# EAGLE design VGA-OSCI_SMD (EAGLE 6.6.0)
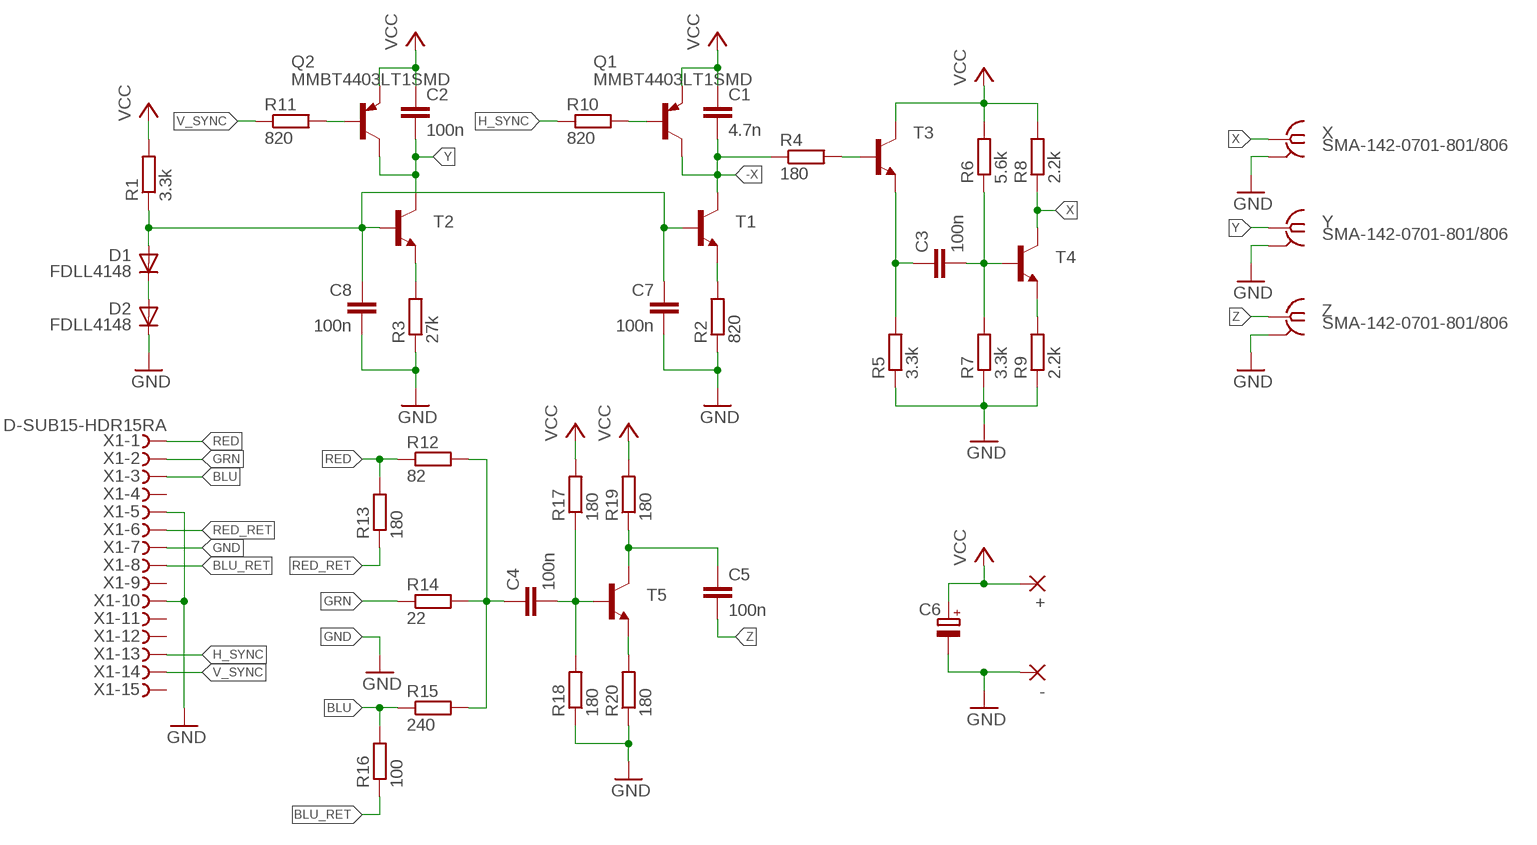
[diagram p0: schematic, sheet 1]

## Parts
+  WIREPADSMD1,27-254  [SMD1,27-2,54]
-  WIREPADSMD1,27-254  [SMD1,27-2,54]
C1  4.7n  C-EUC0603  [C0603]
C2  100n  C-EUC0603  [C0603]
C3  100n  C-EUC0603  [C0603]
C4  100n  C-EUC0603  [C0603]
C5  100n  C-EUC0603  [C0603]
C6  CPOL-EU153CLV-0810  [153CLV-0810]
C7  100n  C-EUC0603  [C0603]
C8  100n  C-EUC0603  [C0603]
D1  FDLL4148  DIODE-SOD80C  [SOD80C]
D2  FDLL4148  DIODE-SOD80C  [SOD80C]
Q1  MMBT4403LT1SMD  MMBT4403LT1-PNP-SOT23-BEC  [SOT23-BEC]
Q2  MMBT4403LT1SMD  MMBT4403LT1-PNP-SOT23-BEC  [SOT23-BEC]
R1  3.3k  R-EU_R0603  [R0603]
R2  820  R-EU_R0603  [R0603]
R3  27k  R-EU_R0603  [R0603]
R4  180  R-EU_R0603  [R0603]
R5  3.3k  R-EU_R0603  [R0603]
R6  5.6k  R-EU_R0603  [R0603]
R7  3.3k  R-EU_R0603  [R0603]
R8  2.2k  R-EU_R0603  [R0603]
R9  2.2k  R-EU_R0603  [R0603]
R10  820  R-EU_R0603  [R0603]
R11  820  R-EU_R0603  [R0603]
R12  82  R-EU_R0603  [R0603]
R13  180  R-EU_R0603  [R0603]
R14  22  R-EU_R0603  [R0603]
R15  240  R-EU_R0603  [R0603]
R16  100  R-EU_R0603  [R0603]
R17  180  R-EU_R0603  [R0603]
R18  180  R-EU_R0603  [R0603]
R19  180  R-EU_R0603  [R0603]
R20  180  R-EU_R0603  [R0603]
T1  MMBT2222ALT1-NPN-SOT23-BEC  [SOT23-BEC]
T2  MMBT2222ALT1-NPN-SOT23-BEC  [SOT23-BEC]
T3  MMBT2222ALT1-NPN-SOT23-BEC  [SOT23-BEC]
T4  MMBT2222ALT1-NPN-SOT23-BEC  [SOT23-BEC]
T5  MMBT2222ALT1-NPN-SOT23-BEC  [SOT23-BEC]
X  SMA-142-0701-801/806  [J502-ND-142-0701-801/806]
X1  D-SUB15-HDR15RA  [HDR15RA]
Y  SMA-142-0701-801/806  [J502-ND-142-0701-801/806]
Z  SMA-142-0701-801/806  [J502-ND-142-0701-801/806]

## Nets
-X: C1.2 Q1.C R4.1 T1.C
BLU: R15.1 R16.2 X1.3
BLU_RET: R16.1 X1.8
GND: -.1(P) C6.- C7.2 C8.2 D2.C R2.1 R3.1 R5.1 R7.1 R9.1 R18.1 R20.1 X1.5 X1.7 X1.10 X.G@1 X.G@2 X.G@3 X.G@4 Y.G@1 Y.G@2 Y.G@3 Y.G@4 Z.G@1 Z.G@2 Z.G@3 Z.G@4
GRN: R14.1 X1.2
GRY_SCL: C4.1 R12.2 R14.2 R15.2
H_SYNC: R10.1 X1.13
N$1: D1.C D2.A
N$2: C7.1 C8.1 D1.A R1.1 T1.B T2.B
N$3: R2.2 T1.E
N$4: R3.2 T2.E
N$5: Q2.B R11.2
N$6: R9.2 T4.E
N$7: C3.2 R6.1 R7.2 T4.B
N$8: C3.1 R5.2 T3.E
N$9: R4.2 T3.B
N$10: Q1.B R10.2
N$11: C4.2 R17.1 R18.2 T5.B
N$13: C5.1 R19.1 T5.C
N$14: R20.2 T5.E
RED: R12.1 R13.2 X1.1
RED_RET: R13.1 X1.6
V_SYNC: R11.1 X1.14
VCC: +.1(P) C1.1 C2.1 C6.+ Q1.E Q2.E R1.2 R6.2 R8.2 R17.2 R19.2 T3.C
X: R8.1 T4.C X.1
Y: C2.2 Q2.C T2.C Y.1
Z: C5.2 Z.1
Unconnected: X1.4 X1.9 X1.11 X1.12 X1.15

## Library data of the parts
+ - = wirepad:WIREPAD: Wire PAD connect wire on PCB
C1-C5 C7 C8 = rcl:C-EU: CAPACITOR, European symbol
C6 = rcl:CPOL-EU: POLARIZED CAPACITOR, European symbol
D1 D2 = diode:DIODE-: DIODE
Q1 Q2 = transistor:*-PNP-: PNP Transistror
R1-R20 = rcl:R-EU_: RESISTOR, European symbol
T1-T5 = transistor:*-NPN-: NPN Transistror BF959 corrected 2008.03.06
X Y Z = con-coax:SMA-: SMA 50 Ohm End Launch Jack Receptacle - Round Contact Johnson Components Source: www.johnsoncomponents.com .. J502-ND.pdf; MF: JOHNSON COMPONENTS; MPN: 142-0701-801; OC_FARNELL: 1608592; OC_NEWARK: 90F2624
X1 = con-thomas-betts:D-SUB15-: D-Subminiatur Connector Source: Electronioc Interconnects European Edition 1998; OC_FARNELL: unknown; OC_NEWARK: unknown

## Board
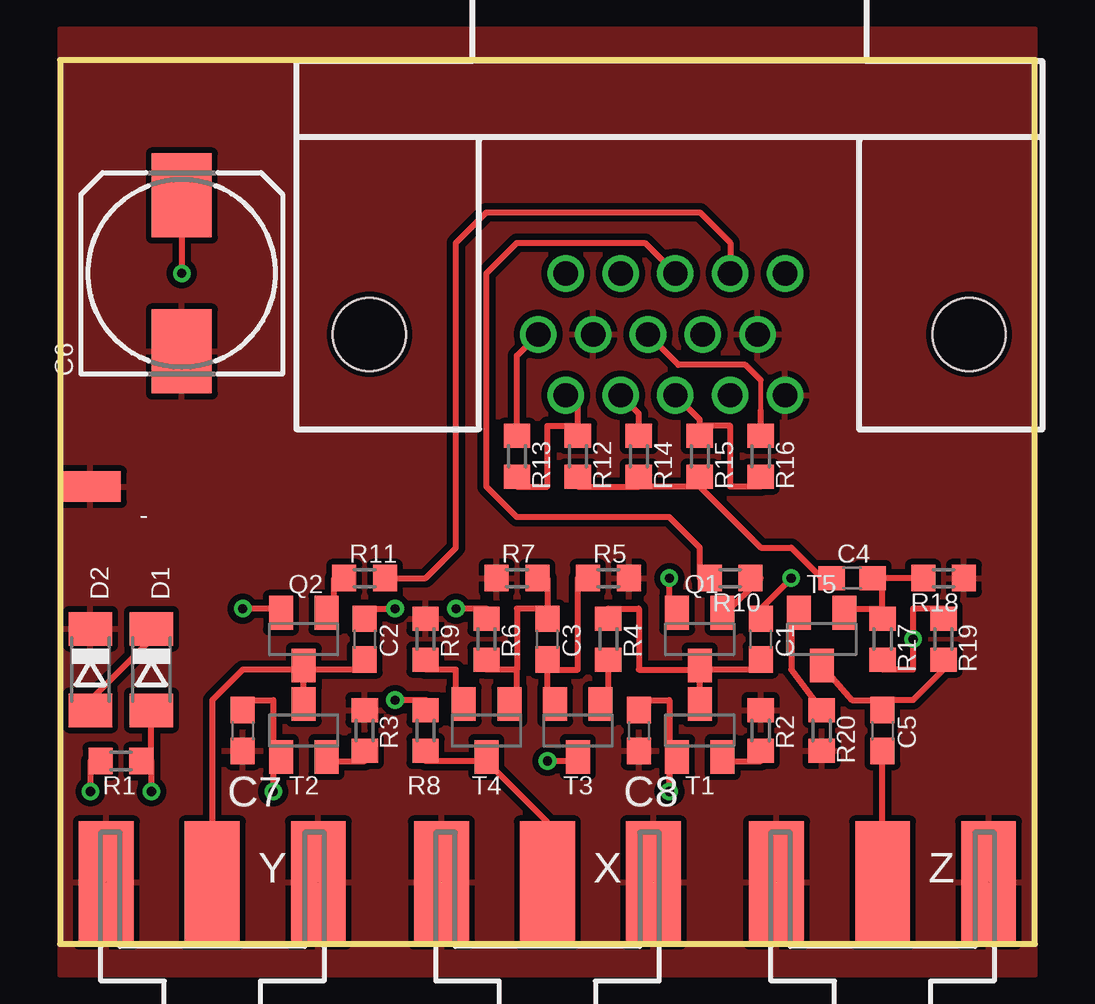
[diagram p1: board, top side]
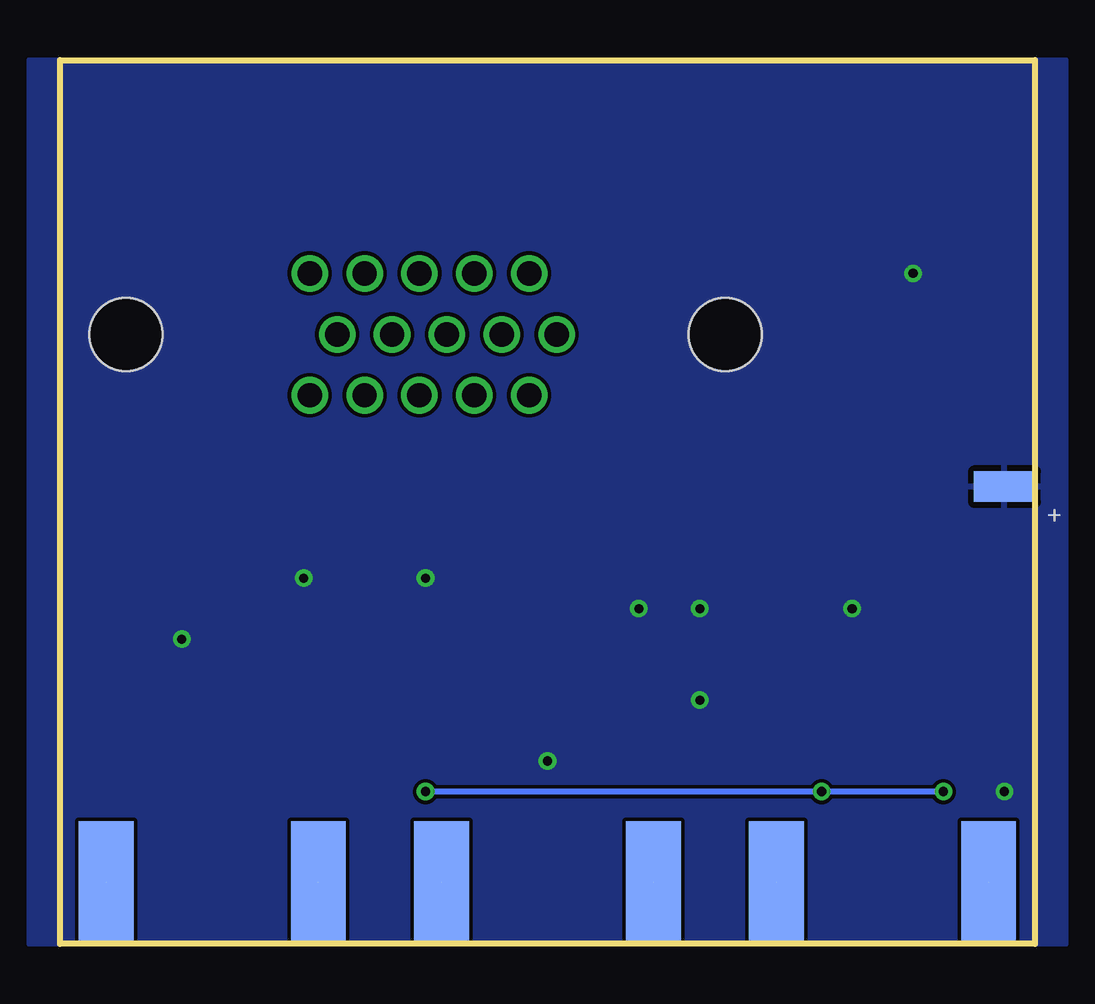
[diagram p2: board, bottom side, seen from below]

Size 40.64 x 36.83 mm. Coordinates in mm from the lower left corner, seen from the top.
Outline: 0,0 40.64,0 40.64,36.83 0,36.83 0,0
Copper layers (1*16): Top 0.035mm / dielectric 1.5mm / Bottom 0.035mm
Design rules "oshpark": minimum track width 6mil, minimum drill 13mil, track to track 6mil, track to pad 6mil, pad to pad 6mil, via to via 6mil, smd to smd 6mil, copper to edge 0mil, drill to drill 8mil, minimum pad ring 10mil, minimum via ring 7mil, stop-mask expansion 4mil, vias tented up to drill 100mil, thermal gap 10mil

### Footprints (pad centres in the part's own frame; a part is rotated, then mirrored left to right if it is on the bottom)
SMD1,27-2,54 = smd 1.27 x 2.54: 1 0,0
C0603 = smd 1.1 x 1: 1 -0.85,0; 2 0.85,0
153CLV-0810 = smd 3.5 x 2.5: + 3.25,0; - -3.25,0
SOD80C = smd 1.4 x 1.8: A 1.7,0; C -1.7,0
SOT23-BEC = smd 1 x 1.4: B -0.95,-1.1; C 0,1.1; E 0.95,-1.1
R0603 = smd 1 x 1.1: 1 -0.85,0; 2 0.85,0
J502-ND-142-0701-801/806 = smd 5.08 x 2.286: 1 2.565,0; G@1 2.565,4.42; G@2 2.565,-4.42 | smd 5.08 x 2.286 bottom: G@3 2.565,4.42; G@4 2.565,-4.42
HDR15RA = drill 1.016: 1 4.318,2.54; 2 2.032,2.54; 3 -0.254,2.54; 4 -2.54,2.54; 5 -4.826,2.54; 6 5.461,0; 7 3.175,0; 8 0.889,0; 9 -1.397,0; 10 -3.683,0; 11 4.318,-2.54; 12 2.032,-2.54; 13 -0.254,-2.54; 14 -2.54,-2.54; 15 -4.826,-2.54 | hole 3.048: -12.497,0; 12.497,0

### Placement (x,y rotation side)
+  1.27,19.05 90 bottom
-  1.27,19.05 90 top
C1  29.21,12.7 270 top
C2  12.7,12.7 270 top
C3  20.32,12.7 90 top
C4  33.02,15.24 0 top
C5  34.29,8.89 270 top
C6  5.08,27.94 90 top
C7  7.62,8.89 270 top
C8  24.13,8.89 270 top
D1  3.81,11.43 270 top
D2  1.27,11.43 270 top
Q1  26.67,12.7 180 top
Q2  10.16,12.7 180 top
R1  2.54,7.62 180 top
R2  29.21,8.89 270 top
R3  12.7,8.89 270 top
R4  22.86,12.7 270 top
R5  22.86,15.24 180 top
R6  17.78,12.7 90 top
R7  19.05,15.24 0 top
R8  15.24,8.89 90 top
R9  15.24,12.7 270 top
R10  27.94,15.24 0 top
R11  12.7,15.24 180 top
R12  21.59,20.32 270 top
R13  19.05,20.32 270 top
R14  24.13,20.32 270 top
R15  26.67,20.32 270 top
R16  29.21,20.32 270 top
R17  34.29,12.7 270 top
R18  36.83,15.24 180 top
R19  36.83,12.7 90 top
R20  31.75,8.89 90 top
T1  26.67,8.89 0 top
T2  10.16,8.89 0 top
T3  21.59,8.89 180 top
T4  17.78,8.89 180 top
T5  31.75,12.7 180 top
X  20.32,0 90 top
X1  25.4,25.4 180 top
Y  6.35,0 90 top
Z  34.29,0 90 top

### Tracks (layer width: path | path; a pad name or v marks a point on that pad's centre or on a via)
-X
  Top 0.254: T1.C 26.67,11.43 | Q1.C 26.67,11.43 | 26.67,11.43 29.21,11.43 C1.2 | R4.1 22.86,13.97 24.13,13.97 24.13,11.43 26.67,11.43
BLU
  Top 0.254: 26.67,21.59 26.67,21.84 X1.3 | R16.2 29.21,19.05 27.94,19.05 27.94,21.59 26.67,21.59 | 26.67,21.59 R15.1
BLU_RET
  Top 0.203: 29.21,22.22 29.21,23.5
  Top 0.254: R16.1 29.21,22.22 | 29.21,23.5 28.57,24.13 25.78,24.13 X1.8
GND  (6 unrouted)
  pour Top (isolate 0.254): 0,-1.27 40.64,-1.27 40.64,38.1 0,38.1
GRN
  Top 0.254: R14.1 24.13,22.1 X1.2
GRY_SCL
  Top 0.254: R12.2 21.59,19.05 24.13,19.05 | R15.2 26.67,19.05 | 26.67,19.05 24.13,19.05 | 24.13,19.05 R14.2 | 26.67,19.05 29.21,16.51 30.48,16.51 31.75,15.24 C4.1
H_SYNC
  Top 0.254: R10.1 26.67,15.24 26.67,16.51 25.4,17.78 19.05,17.78 17.78,19.05 17.78,27.94 19.05,29.21 24.38,29.21 X1.13
N$1
  Top 0.254: D2.A 1.27,10.16 3.81,12.7 D1.C
N$2  (via drill 0.38)
  Top 0.254: R1.1 3.81,7.62 | 3.81,7.62 D1.A | 3.81,7.62 v3.81,6.35 | 8.89,7.62 9.04,7.62 T2.B 9.06,7.79 8.89,7.62 | 8.89,7.62 v8.89,6.35 | T1.B 25.55,7.62 25.4,7.62 v25.4,6.35 25.4,10.16 24.13,10.16 C8.1 | C7.1 7.62,10.16 8.89,10.16 8.89,7.62
  Bottom 0.254: v3.81,6.35 v8.89,6.35 v25.4,6.35
N$3
  Top 0.254: T1.E 27.77,7.79 27.94,7.62 29.21,7.62 R2.2
N$4
  Top 0.254: T2.E 11.26,7.79 11.43,7.62 12.7,7.62 R3.2
N$5
  Top 0.254: Q2.B 11.26,13.8 11.43,13.97 11.43,15.24 R11.2
N$6
  Top 0.254: T4.E 16.68,9.99 16.51,10.16 16.51,11.43 15.24,11.43 R9.2
N$7
  Top 0.254: C3.2 20.32,13.97 | 19.05,11.43 19.05,13.97 20.32,13.97 | R7.2 20.32,15.24 20.32,13.97 | 19.05,11.43 19.05,10.16 18.88,9.99 T4.B | 19.05,11.43 17.78,11.43 R6.1
N$8
  Top 0.254: T3.E 20.49,9.99 20.32,10.16 20.32,11.43 | 20.32,11.43 21.59,11.43 21.59,15.24 R5.2 | C3.1 20.32,11.43
N$9
  Top 0.254: T3.B 22.69,9.99 22.86,10.16 R4.2
N$10
  Top 0.254: Q1.B 27.77,13.8 29.21,15.24 R10.2
N$11
  Top 0.254: T5.B 32.85,13.8 33.02,13.97 34.29,13.97 | R18.2 C4.2 34.29,15.24 34.29,13.97 | R17.1 34.29,13.97
N$13
  Top 0.254: T5.C 33.02,10.16 34.29,10.16 | R19.1 36.83,11.43 35.56,10.16 34.29,10.16 | 34.29,10.16 C5.1
N$14
  Top 0.254: T5.E 30.65,13.8 30.48,13.97 30.48,11.43 R20.2
RED
  Top 0.254: 21.59,21.59 21.59,22.35 X1.1 | R13.2 19.05,19.05 20.32,19.05 20.32,21.59 21.59,21.59 | 21.59,21.59 R12.1
RED_RET
  Top 0.254: R13.1 19.05,24.51 X1.6
V_SYNC
  Top 0.254: R11.1 15.24,15.24 16.51,16.51 16.51,29.21 17.78,30.48 26.67,30.48 27.94,29.21 X1.14
VCC  (via drill 0.38)
  Top 0.254: Q2.E 9.06,13.8 8.89,13.97 v7.62,13.97 | C2.1 12.7,13.97 v13.97,13.97 | R6.2 17.78,13.97 v16.51,13.97 | Q1.E 25.57,13.8 25.4,13.97 v25.4,15.24 | C1.1 29.21,13.97 v30.48,15.24 | T3.C 21.59,7.62 v20.32,7.62 | R8.2 15.24,10.16 v13.97,10.16 | R17.2 34.29,11.43 35.56,11.43 v35.56,12.7 35.56,13.97 36.83,13.97 R19.2 | R1.2 1.27,7.62 v1.27,6.35 | C6.+ v5.08,27.94
  pour Bottom: -1.27,0 41.91,0 41.91,36.83 -1.27,36.83
X
  Top 0.254: T4.C 17.78,7.62 | 17.78,7.62 15.24,7.62 R8.1 | 17.78,7.62 20.32,5.08 X.1
Y
  Top 0.254: C2.2 12.7,11.43 10.16,11.43 | 10.16,11.43 Q2.C | T2.C 10.16,11.43 | 10.16,11.43 7.62,11.43 6.35,10.16 Y.1
Z
  Top 0.254: Z.1 C5.2